# EAGLE schematic learn (EAGLE 9.7.0)
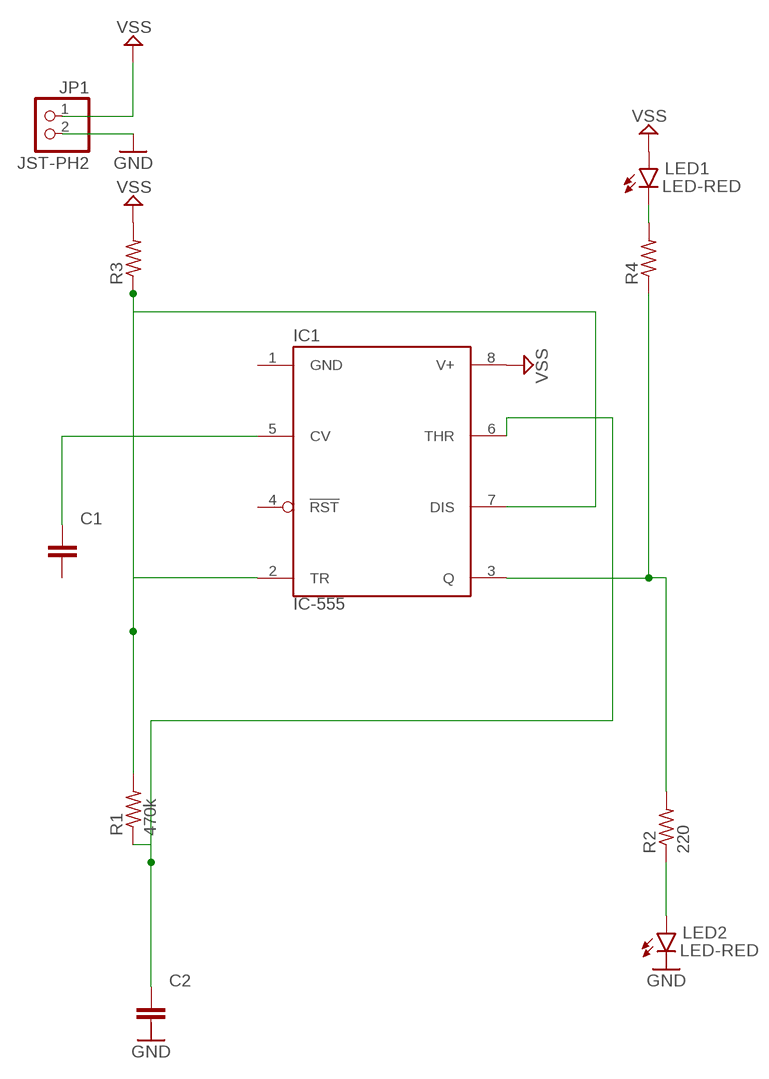
[diagram p0: schematic, sheet 1]

## Parts
C1  C_CHIP-1206(3216-METRIC)  [CAPC3216X135]
C2  C_CHIP-1206(3216-METRIC)  [CAPC3216X135]
IC1  IC-555  LM555ND0008A  [D0008A]
JP1  JST-PH2  JSTPH2  [JSTPH2]
LED1  LED-RED  LED_CHIP_RED-1608  [LEDC1608X39N_R]
LED2  LED-RED  LED_CHIP_RED-1608  [LEDC1608X39N_R]
R1  470k  R-US_MELF(5924-METRIC)  [RESMELF5924]
R2  220  R-US_MELF(5924-METRIC)  [RESMELF5924]
R3  R-US_MELF(5924-METRIC)  [RESMELF5924]
R4  R-US_MELF(5924-METRIC)  [RESMELF5924]

## Nets
GND: JP1.2
N$1: IC1.2(TR) IC1.7(DIS) R1.2 R3.1
N$2: C1.1 IC1.5(CV)
N$3: IC1.3(Q) R2.2 R4.1
N$4: LED1.1(C) R4.2
N$5: LED2.2(A) R2.1
N$6: C2.1 IC1.6(THR) R1.1
VSS: IC1.8(V+) JP1.1 LED1.2(A) R3.2
Unconnected: C1.2 C2.2 IC1.4(!RST) LED2.1(C)

## Power pins joined to a net without a drawn wire
GND: IC1.1(GND)

## Library data of the parts
C1 C2 = Tutorial - Fusion 360:C: Capacitor - Generic; CATEGORY: Capacitor
IC1 = Tutorial - Fusion 360:LM555N
JP1 = Tutorial - Fusion 360:JSTPH2
LED1 LED2 = Tutorial - Fusion 360:LED_CHIP: LED - Generic; CATEGORY: Opto-Electronic; COLOR: Red; SUB-CATEGORY: LED
R1-R4 = Tutorial - Fusion 360:R-US: Resistor Fixed - ANSI; CATEGORY: Resistor; SUB-CATEGORY: Fixed